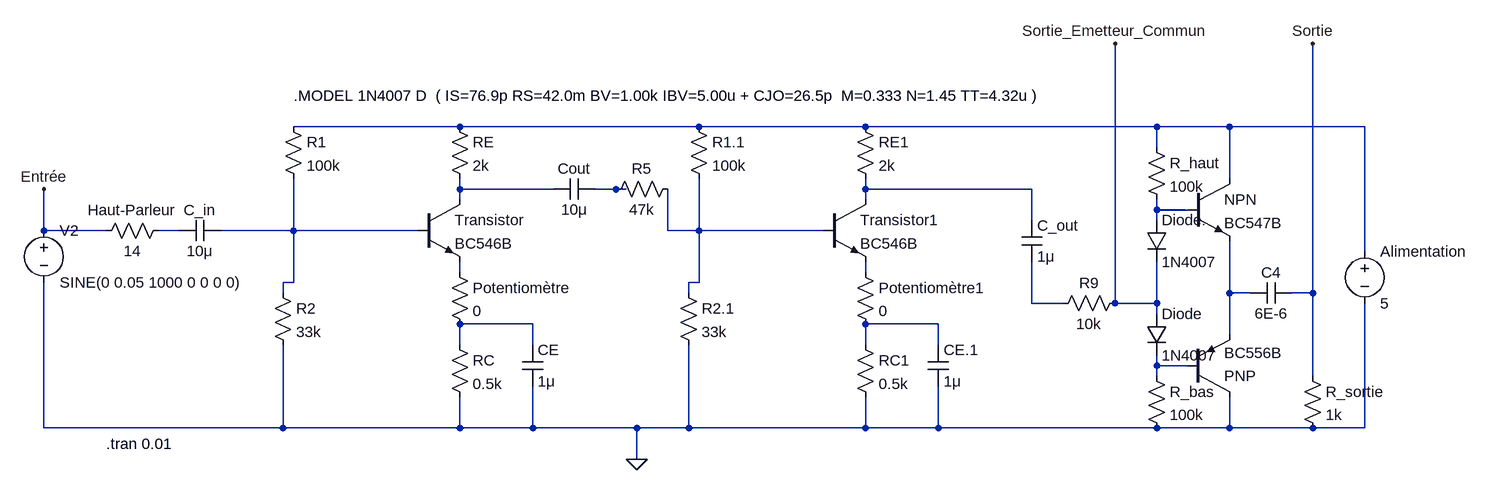
[diagram p0: schematic Cascade+PushPull-valeur good.asc]
Cascade+PushPull-valeur good.asc, the LTspice schematic file:
Version 4
SHEET 1 2696 1204
WIRE 368 16 112 16
WIRE 736 16 368 16
WIRE 992 16 736 16
WIRE 1440 16 992 16
WIRE 1552 16 1440 16
WIRE 1760 16 1552 16
WIRE 1440 48 1440 16
WIRE 1552 96 1552 16
WIRE 368 112 368 96
WIRE 512 112 368 112
WIRE 608 112 576 112
WIRE 624 112 608 112
WIRE 992 112 992 96
WIRE 1248 112 992 112
WIRE 368 128 368 112
WIRE 992 128 992 112
WIRE 1440 144 1440 128
WIRE 1488 144 1440 144
WIRE 1248 160 1248 112
WIRE 1440 160 1440 144
WIRE -272 176 -272 112
WIRE -176 176 -272 176
WIRE -64 176 -96 176
WIRE 112 176 112 96
WIRE 112 176 0 176
WIRE 304 176 112 176
WIRE 688 176 688 112
WIRE 736 176 736 96
WIRE 736 176 688 176
WIRE 928 176 736 176
WIRE 1760 208 1760 16
WIRE 368 240 368 224
WIRE 992 240 992 224
WIRE 112 256 112 176
WIRE 112 256 96 256
WIRE 736 256 736 176
WIRE 736 256 720 256
WIRE 96 272 96 256
WIRE 720 272 720 256
WIRE 1552 272 1552 192
WIRE 1584 272 1552 272
WIRE 1680 272 1680 -112
WIRE 1680 272 1648 272
WIRE 1248 288 1248 224
WIRE 1296 288 1248 288
WIRE 1376 288 1376 -112
WIRE 1440 288 1440 224
WIRE 1440 288 1376 288
WIRE 1440 304 1440 288
WIRE 480 320 368 320
WIRE 1104 320 992 320
WIRE 1552 336 1552 272
WIRE 368 352 368 320
WIRE 480 352 480 320
WIRE 992 352 992 320
WIRE 1104 352 1104 320
WIRE 1440 384 1440 368
WIRE 1488 384 1440 384
WIRE 1440 400 1440 384
WIRE 1680 400 1680 272
WIRE -272 480 -272 256
WIRE 96 480 96 352
WIRE 96 480 -272 480
WIRE 368 480 368 432
WIRE 368 480 96 480
WIRE 480 480 480 416
WIRE 480 480 368 480
WIRE 640 480 480 480
WIRE 720 480 720 352
WIRE 720 480 640 480
WIRE 992 480 992 432
WIRE 992 480 720 480
WIRE 1104 480 1104 416
WIRE 1104 480 992 480
WIRE 1440 480 1104 480
WIRE 1552 480 1552 432
WIRE 1552 480 1440 480
WIRE 1680 480 1552 480
WIRE 1760 480 1760 288
WIRE 1760 480 1680 480
WIRE 640 528 640 480
FLAG 640 528 0
FLAG 1680 -112 Sortie
FLAG -272 112 Entrée
FLAG 1376 -112 Sortie_Emetteur_Commun
SYMBOL res 352 0 R0
SYMATTR InstName RE
SYMATTR Value 2k
SYMBOL res 352 336 R0
SYMATTR InstName RC
SYMATTR Value 0.5k
SYMBOL res 96 0 R0
SYMATTR InstName R1
SYMATTR Value 100k
SYMBOL res 80 256 R0
SYMATTR InstName R2
SYMATTR Value 33k
SYMBOL npn 304 128 R0
SYMATTR InstName Transistor
SYMATTR Value BC546B
SYMBOL cap 576 96 R90
WINDOW 0 0 32 VBottom 2
WINDOW 3 32 32 VTop 2
SYMATTR InstName Cout
SYMATTR Value 10μ
SYMBOL cap 0 160 R90
WINDOW 0 0 32 VBottom 2
WINDOW 3 32 32 VTop 2
SYMATTR InstName C_in
SYMATTR Value 10μ
SYMBOL cap 464 352 R0
SYMATTR InstName CE
SYMATTR Value 1μ
SYMBOL res -80 160 R90
WINDOW 0 0 56 VBottom 2
WINDOW 3 32 56 VTop 2
SYMATTR InstName Haut-Parleur
SYMATTR Value 14
SYMBOL res 352 224 R0
SYMATTR InstName Potentiomètre
SYMATTR Value 0
SYMBOL res 976 0 R0
SYMATTR InstName RE1
SYMATTR Value 2k
SYMBOL res 976 336 R0
SYMATTR InstName RC1
SYMATTR Value 0.5k
SYMBOL res 720 0 R0
SYMATTR InstName R1.1
SYMATTR Value 100k
SYMBOL res 704 256 R0
SYMATTR InstName R2.1
SYMATTR Value 33k
SYMBOL npn 928 128 R0
SYMATTR InstName Transistor1
SYMATTR Value BC546B
SYMBOL cap 1232 160 R0
SYMATTR InstName C_out
SYMATTR Value 1μ
SYMBOL cap 1088 352 R0
SYMATTR InstName CE.1
SYMATTR Value 1μ
SYMBOL res 976 224 R0
SYMATTR InstName Potentiomètre1
SYMATTR Value 0
SYMBOL res 704 96 R90
WINDOW 0 0 56 VBottom 2
WINDOW 3 32 56 VTop 2
SYMATTR InstName R5
SYMATTR Value 47k
SYMBOL res 1424 32 R0
SYMATTR InstName R_haut
SYMATTR Value 100k
SYMBOL res 1424 384 R0
SYMATTR InstName R_bas
SYMATTR Value 100k
SYMBOL diode 1424 160 R0
SYMATTR InstName Diode.
SYMATTR Value 1N4007
SYMBOL diode 1424 304 R0
SYMATTR InstName Diode
SYMATTR Value 1N4007
SYMBOL npn 1488 96 R0
SYMATTR InstName NPN
SYMATTR Value BC547B
SYMBOL pnp 1488 432 M180
SYMATTR InstName PNP
SYMATTR Value BC556B
SYMBOL cap 1648 256 R90
WINDOW 0 0 32 VBottom 2
WINDOW 3 32 32 VTop 2
SYMATTR InstName C4
SYMATTR Value 6E-6
SYMBOL res 1664 384 R0
SYMATTR InstName R_sortie
SYMATTR Value 1k
SYMBOL res 1392 272 R90
WINDOW 0 0 56 VBottom 2
WINDOW 3 32 56 VTop 2
SYMATTR InstName R9
SYMATTR Value 10k
SYMBOL voltage 1760 192 R0
WINDOW 123 0 0 Left 0
WINDOW 39 0 0 Left 0
SYMATTR InstName Alimentation
SYMATTR Value 5
SYMBOL voltage -272 160 R0
WINDOW 123 24 124 Left 2
WINDOW 39 0 0 Left 0
SYMATTR InstName V2
SYMATTR Value SINE(0 0.05 1000 0 0 0 0)
TEXT -176 504 Left 2 !.tran 0.01
TEXT 112 -32 Left 2 !.MODEL 1N4007 D  ( IS=76.9p RS=42.0m BV=1.00k IBV=5.00u + CJO=26.5p  M=0.333 N=1.45 TT=4.32u )

The netlist it stands for:
* Cascade+PushPull-valeur good.asc
RE N001 N002 2k
RC N013 0 0.5k
R1 N001 N007 100k
R2 N007 0 33k
Q§Transistor N002 N007 N009 0 BC546B
Cout N003 N002 10μ
C_in N007 N006 10μ
CE N013 0 1μ
R§Haut-Parleur N006 Entrée 14
R§Potentiomètre N009 N013 0
RE1 N001 N004 2k
RC1 N014 0 0.5k
R1.1 N001 N008 100k
R2.1 N008 0 33k
Q§Transistor1 N004 N008 N010 0 BC546B
C_out N004 N012 1μ
CE.1 N014 0 1μ
R§Potentiomètre1 N010 N014 0
R5 N008 N003 47k
R_haut N001 N005 100k
R_bas N015 0 100k
Diode. N005 Sortie_Emetteur_Commun 1N4007
Diode Sortie_Emetteur_Commun N015 1N4007
Q§NPN N001 N005 N011 0 BC547B
Q§PNP 0 N015 N011 0 BC556B
C4 Sortie N011 6E-6
R_sortie Sortie 0 1k
R9 Sortie_Emetteur_Commun N012 10k
V§Alimentation N001 0 5
V2 Entrée 0 SINE(0 0.05 1000 0 0 0 0)
.model D D
.lib standard.dio
.model NPN NPN
.model PNP PNP
.lib standard.bjt
.tran 0.01
.MODEL 1N4007 D  ( IS=76.9p RS=42.0m BV=1.00k IBV=5.00u + CJO=26.5p  M=0.333 N=1.45 TT=4.32u )
.backanno
.end